# EAGLE schematic Clock (EAGLE 6.5.0)
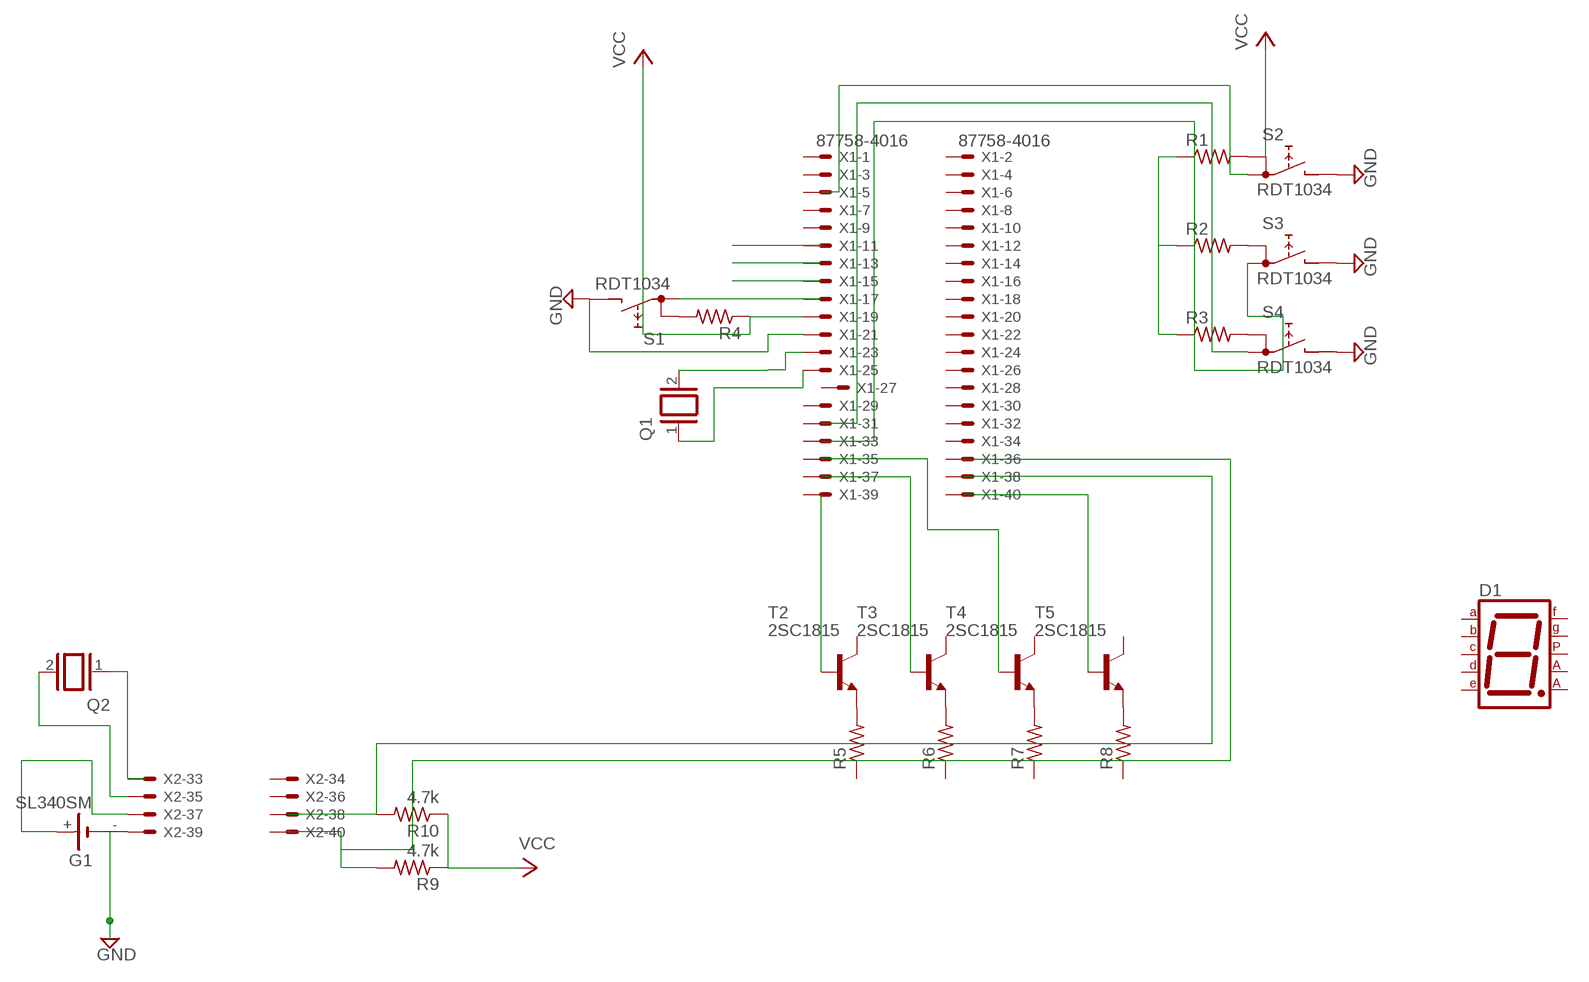
[diagram p0: schematic, sheet 1]

## Parts
D1  7SEG-CA  [7SEG-13]
G1  SL340SM  [SL-340/SM3.6V]
Q1  XTAL  [Q]
Q2  XTAL  [Q]
R1  R-US_MELF0207R  [MINI_MELF-0207R]
R2  R-US_MELF0207R  [MINI_MELF-0207R]
R3  R-US_MELF0207R  [MINI_MELF-0207R]
R4  R-US_MELF0207R  [MINI_MELF-0207R]
R5  R-US_MELF0207R  [MINI_MELF-0207R]
R6  R-US_MELF0207R  [MINI_MELF-0207R]
R7  R-US_MELF0207R  [MINI_MELF-0207R]
R8  R-US_MELF0207R  [MINI_MELF-0207R]
R9  4.7k  R-US_MELF0207R  [MINI_MELF-0207R]
R10  4.7k  R-US_MELF0207R  [MINI_MELF-0207R]
S1  RDT1034  [RDT1034]
S2  RDT1034  [RDT1034]
S3  RDT1034  [RDT1034]
S4  RDT1034  [RDT1034]
T2  2SC1815  [TO92-ECB]
T3  2SC1815  [TO92-ECB]
T4  2SC1815  [TO92-ECB]
T5  2SC1815  [TO92-ECB]
X1  87758-4016  [87758-4016]
X2  87758-4016  [87758-4016]

## Nets
GND: G1.-@1(-) S1.B S2.B S3.B S4.B X1.21
N$1: R1.2 S2.A
N$2: R2.2 S3.A
N$3: R3.2 S4.A
N$4: R1.1 R2.1 R3.1
N$5: S2.A1
N$6: S4.A1
N$7: S3.A1
N$8: Q1.1 X1.25
N$12: S1.A1
N$13: R4.2 S1.A
N$14: R5.2 T2.E
N$15: R6.2 T3.E
N$16: Q1.2 X1.23
N$17: T5.B
N$18: T4.B
N$19: T3.B
N$20: T2.B
N$21: R7.2 T4.E
N$22: R8.2 T5.E
N$23: G1.- X2.39
N$24: Q2.1
N$25: G1.+ X2.37
N$26: Q2.2 X2.35
N$27: R9.2
N$28: R10.2
VCC: R4.1 R9.1 R10.1 X1.19
Unconnected: D1.1(E) D1.2(D) D1.3(CA1) D1.4(C) D1.5(DP) D1.6(B) D1.7(A) D1.8(CA2) D1.9(F) D1.10(G) R5.1 R6.1 R7.1 R8.1 T2.C T3.C T4.C T5.C X1.1 X1.2 X1.3 X1.4 X1.5 X1.6 X1.7 X1.8 X1.9 X1.10 X1.11 X1.12 X1.13 X1.14 X1.15 X1.16 X1.17 X1.18 X1.20 X1.22 X1.24 X1.26 X1.27 X1.28 X1.29 X1.30 X1.31 X1.32 X1.33 X1.34 X1.35 X1.36 X1.37 X1.38 X1.39 X1.40 X2.1 X2.2 X2.3 X2.4 X2.5 X2.6 X2.7 X2.8 X2.9 X2.10 X2.11 X2.12 X2.13 X2.14 X2.15 X2.16 X2.17 X2.18 X2.19 X2.20 X2.21 X2.22 X2.23 X2.24 X2.25 X2.26 X2.27 X2.28 X2.29 X2.30 X2.31 X2.32 X2.33 X2.34 X2.36 X2.38 X2.40

## Library data of the parts
D1 = special:7SEG-CA: 7-segment DISPLAY single anode, 13 mm
G1 = battery:SL340SM: LI BATTERY Sonnenschein SM-340 3.6 V
Q1 Q2 = special:XTAL: CRYSTAL
R1-R10 = resistor:R-US_: RESISTOR, American symbol
S1-S4 = switch:RDT1034: PUSH SWITCH www.radiohm.com
T2-T5 = transistor:2SC1815: NPN EPITAXIAL TRANSISTOR Source: TOSHIBA .. 2SC1815 1.pdf
X1 X2 = con-molex:87758-4016: 40 Pin - 2mm Dual Row Single Wafer, Vertical T/H HDR Source: http://www.molex.com/pdm_docs/sd/877580616_sd.pdf; MPN: 87758-4016; OC_FARNELL: unknown; OC_NEWARK: 25M5691